# EAGLE design charger_v2 (EAGLE 5.05)
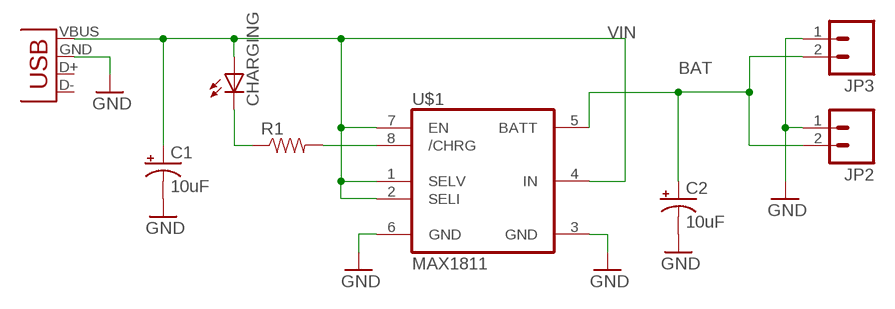
[diagram p0: schematic, sheet 1]

## Parts
C1  10uF  CAP_POL1206  [EIA3216]
C2  10uF  CAP_POL1206  [EIA3216]
CHARGING  LED0603  [LED-0603]
JP2  M02POLAR_LOCK  [MOLEX-1X2_LOCK]
JP3  M02-JST-2MM-SMT  [S2B-PH]
R1  RESISTOR0603  [0603]
U$1  MAX1811  [SO08]
X2  USB-A-H  [USB-A-H]

## Nets
BAT: C2.A(+) JP2.2 JP3.2 U$1.5(BATT)
GND: C1.C(-) C2.C(-) JP2.1 JP3.1 U$1.3(GND) U$1.6(GND) X2.GND(VBUS)
N$2: CHARGING.C R1.1
N$3: R1.2 U$1.8(/CHRG)
VIN: C1.A(+) CHARGING.A U$1.1(SELV) U$1.2(SELI) U$1.4(IN) U$1.7(EN) X2.VBUS(GND)
Unconnected: X2.D+(D-) X2.D-(D+)

## Library data of the parts
C1 C2 = SparkFunEagle-6-6-07:CAP_POL: Capacitor Polarized These are standard SMD and PTH capacitors. Normally 10uF, 47uF, and 100uF in electrolytic and tantalum varieties. Always verify the external diameter of the through hole cap, it varies with capacity, voltage, and manufacturer. The EIA devices should be standard.
CHARGING = SparkFun:LED: LEDs Standard schematic elements and footprints for 5mm, 3mm, 1206, and 0603 sized LEDs. 5mm - Spark Fun Electronics SKU : COM-00529 (and others)
JP2 JP3 = SparkFun:M02: Header 2 Standard 2-pin 0.1" header. Use with straight break away headers (SKU : PRT-00116), right angle break away headers (PRT-00553), swiss pins (PRT-00743), machine pins (PRT-00117), and female headers (PRT-00115). Molex polarized connector foot print use with SKU : PRT-08233 with associated crimp pins and housings.
R1 = SparkFun:RESISTOR: Resistor Basic schematic elements and footprints for 0603, 1206, and PTH 1/10th watt (small) resistors.
U$1 = max1811:MAX1811
X2 = SparkFun:USB: USB Connectors USB-B-PTH is fully proven SKU : PRT-00139 USB-miniB is fully proven SKU : PRT-00587 USB-A-PCB is untested. USB-A-H is throughly reviewed, but untested. Spark Fun Electronics SKU : PRT-00437 USB-B-SMT is throughly reviewed, but untested. Needs silkscreen touching up. USB-A-S has not been used/tested USB-MB-H has not been used/tested

## Board
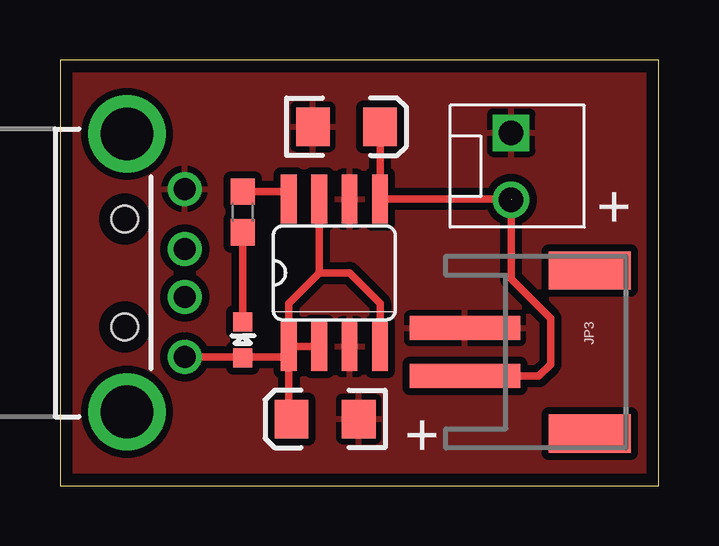
[diagram p1: board, top side]
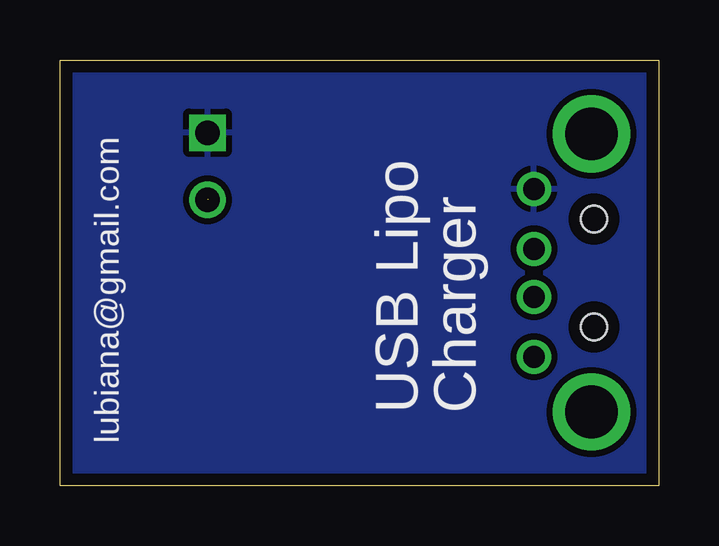
[diagram p2: board, bottom side, seen from below]

Size 24.94 x 17.77 mm. Coordinates in mm from the lower left corner, seen from the top.
Outline: 0,0 24.94,0 24.94,17.77 0,17.77 0,0
Copper layers (1*16): Top 0.035mm / dielectric 1.5mm / Bottom 0.035mm
Design rules "default *": minimum track width 10mil, minimum drill 24mil, track to track 8mil, track to pad 8mil, pad to pad 8mil, via to via 8mil, smd to smd 8mil, copper to edge 20mil, drill to drill 8mil, minimum pad ring 10mil, minimum via ring 8mil, stop-mask expansion 4mil, vias tented up to drill 0mil, thermal gap 10mil

### Footprints (pad centres in the part's own frame; a part is rotated, then mirrored left to right if it is on the bottom)
EIA3216 = smd 1.4 x 1.6: A 1.4,0; C -1.4,0
LED-0603 = smd 0.8 x 0.8: A 0,-0.75; C 0,0.75
MOLEX-1X2_LOCK = drill 1.016 square: 1 -0.127,0 | drill 1.016 round: 2 2.667,0
S2B-PH = smd 1 x 4.6: 1 -1,-3.7; 2 1,-3.7 | smd 1.6 x 3.4: NC1 -3.4,1.5; NC2 3.4,1.5
0603 = smd 1.1 x 1: 1 -0.85,0; 2 0.85,0
SO08 = smd 0.66 x 2.032: 1 -1.905,-3.073; 2 -0.635,-3.073; 3 0.635,-3.073; 4 1.905,-3.073; 5 1.905,3.073; 6 0.635,3.073; 7 -0.635,3.073; 8 -1.905,3.073
USB-A-H = drill 0.914 round: D+ 2.4,1; D- 2.4,-1; GND 2.4,3.5; VBUS 2.4,-3.5 | drill 2.2 round: GND@1 0,5.8; GND@2 0,-5.8 | hole 1.1: -0.1,2.25; -0.1,-2.25

### Placement (x,y rotation side)
C1  11.05,2.79 180 top
C2  11.94,14.99 0 top
CHARGING  7.62,6.1 0 top
JP2  18.8,14.61 270 top
JP3  20.57,5.59 270 top
R1  7.62,11.43 90 top
U$1  11.43,8.89 0 top
X2  2.79,8.89 0 top

### Tracks (layer width: path | path; a pad name or v marks a point on that pad's centre or on a via)
BAT  (1 unrouted)
  Top 0.305: JP3.2 19.95,4.59 20.45,5.08 20.45,6.99 18.8,8.64 18.8,11.96 U$1.5 C2.A
GND
  pour Top (isolate 0.305): -0.25,17.78 25.4,17.78 25.4,0 -0.25,0
  pour Bottom (isolate 0.254): 0,17.91 25.02,17.91 25.02,0 0,0
N$2
  Top 0.305: CHARGING.C R1.1
N$3
  Top 0.254: 9.21,12.28 U$1.8
  Top 0.305: R1.2 9.21,12.28
VIN
  Top 0.254: 7.62,5.39 CHARGING.A | U$1.1 9.4,5.82
  Top 0.305: 10.79,8.89 U$1.7 | 10.79,8.89 9.53,7.62 U$1.1 | U$1.4 13.34,7.62 12.06,8.89 10.79,8.89 | X2.VBUS 7.62,5.39 9.53,5.39 U$1.1 | C1.A 9.53,2.79 U$1.1 | U$1.1 U$1.2

### Text on the board
tPlace: + | +
bPlace: Charger | USB Lipo | lubiana@gmail.com